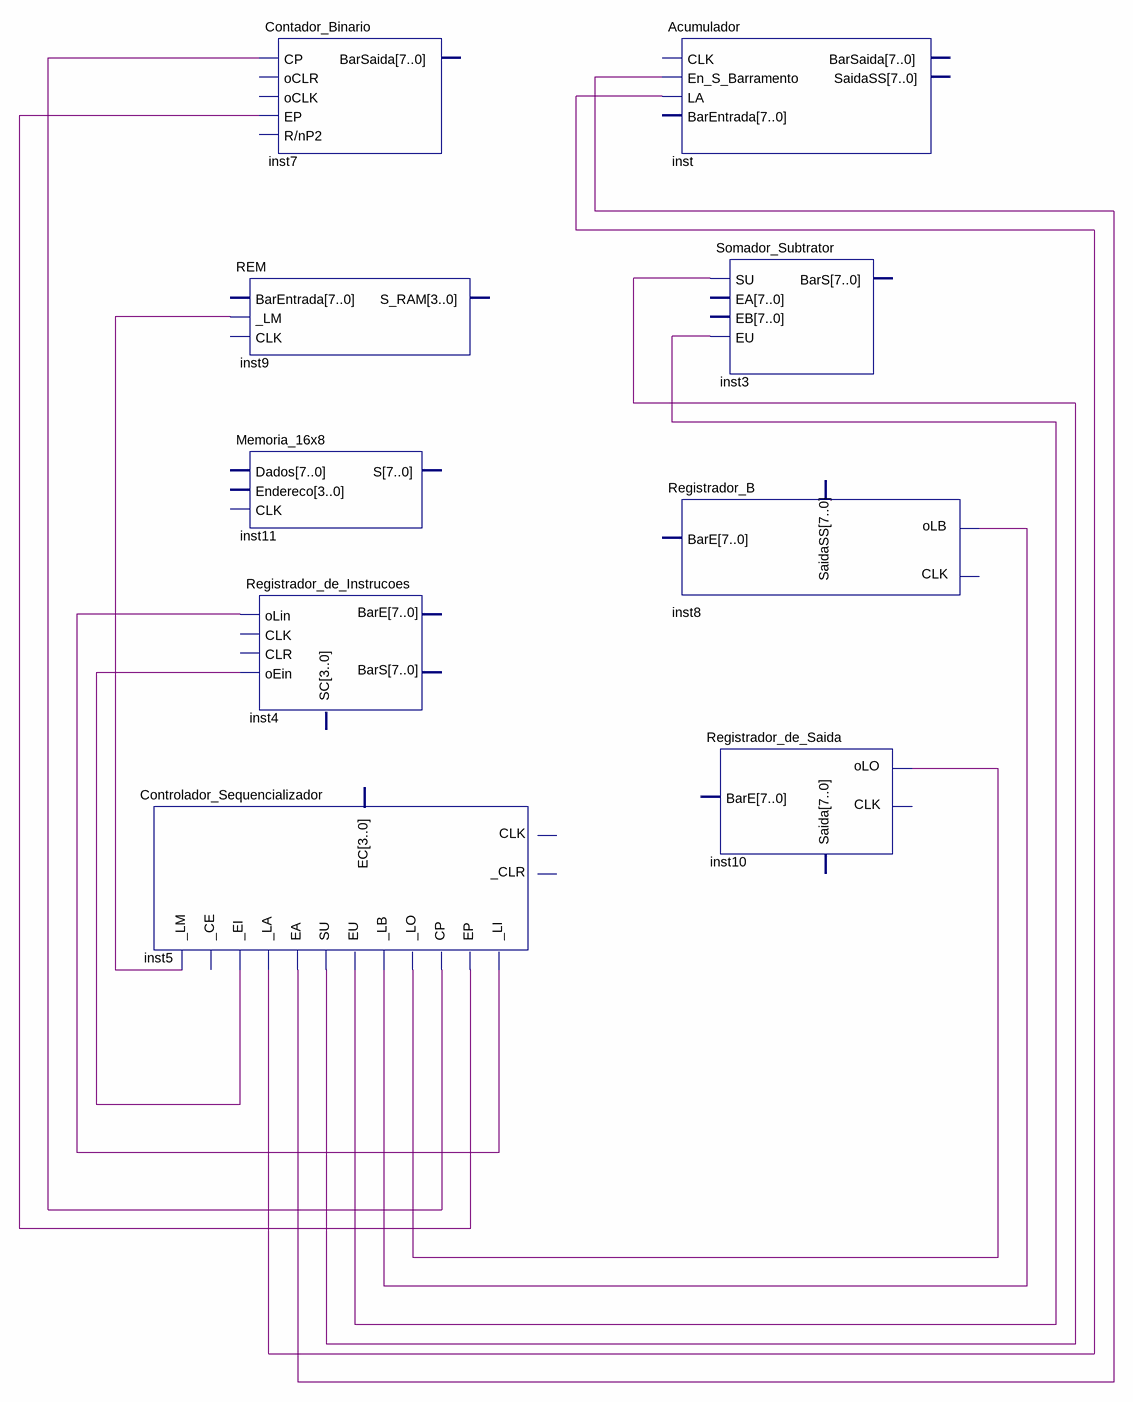
[diagram p0: schematic sheet]
// Quartus schematic Microcomputador.bdf as structural Verilog: 9 symbols, 0 pins
module Microcomputador (
);

  wire inst5__ei, inst5__la, inst5__lb, inst5__li, inst5__lm, inst5__lo, inst5_cp, inst5_ea, inst5_ep,
       inst5_eu, inst5_su;

  Controlador_Sequencializador inst5 (
    ._LM(inst5__lm), ._EI(inst5__ei), ._LA(inst5__la), .EA(inst5_ea), .SU(inst5_su), .EU(inst5_eu),
    ._LB(inst5__lb), ._LO(inst5__lo), .CP(inst5_cp), .EP(inst5_ep), ._LI(inst5__li));  // open: _CLR, EC, CLK, _CE
  Contador_Binario inst7 (.CP(inst5_cp), .EP(inst5_ep));  // open: oCLR, oCLK, R/nP2, BarSaida
  REM inst9 (._LM(inst5__lm));  // open: BarEntrada, CLK, S_RAM
  Memoria_16x8 inst11 ();  // open: Dados, Endereco, CLK, S
  Registrador_de_Instrucoes inst4 (.oLin(inst5__li), .oEin(inst5__ei));  // open: BarE, CLK, CLR, SC, BarS
  Acumulador inst (.En_S_Barramento(inst5_ea), .LA(inst5__la));  // open: CLK, BarEntrada, BarSaida, SaidaSS
  Registrador_B inst8 (.oLB(inst5__lb));  // open: BarE, CLK, SaidaSS
  Somador_Subtrator inst3 (.SU(inst5_su), .EU(inst5_eu));  // open: EA, EB, BarS
  Registrador_de_Saida inst10 (.oLO(inst5__lo));  // open: BarE, CLK, Saida
endmodule
